# EAGLE schematic megacard_pipico (EAGLE 4.16)
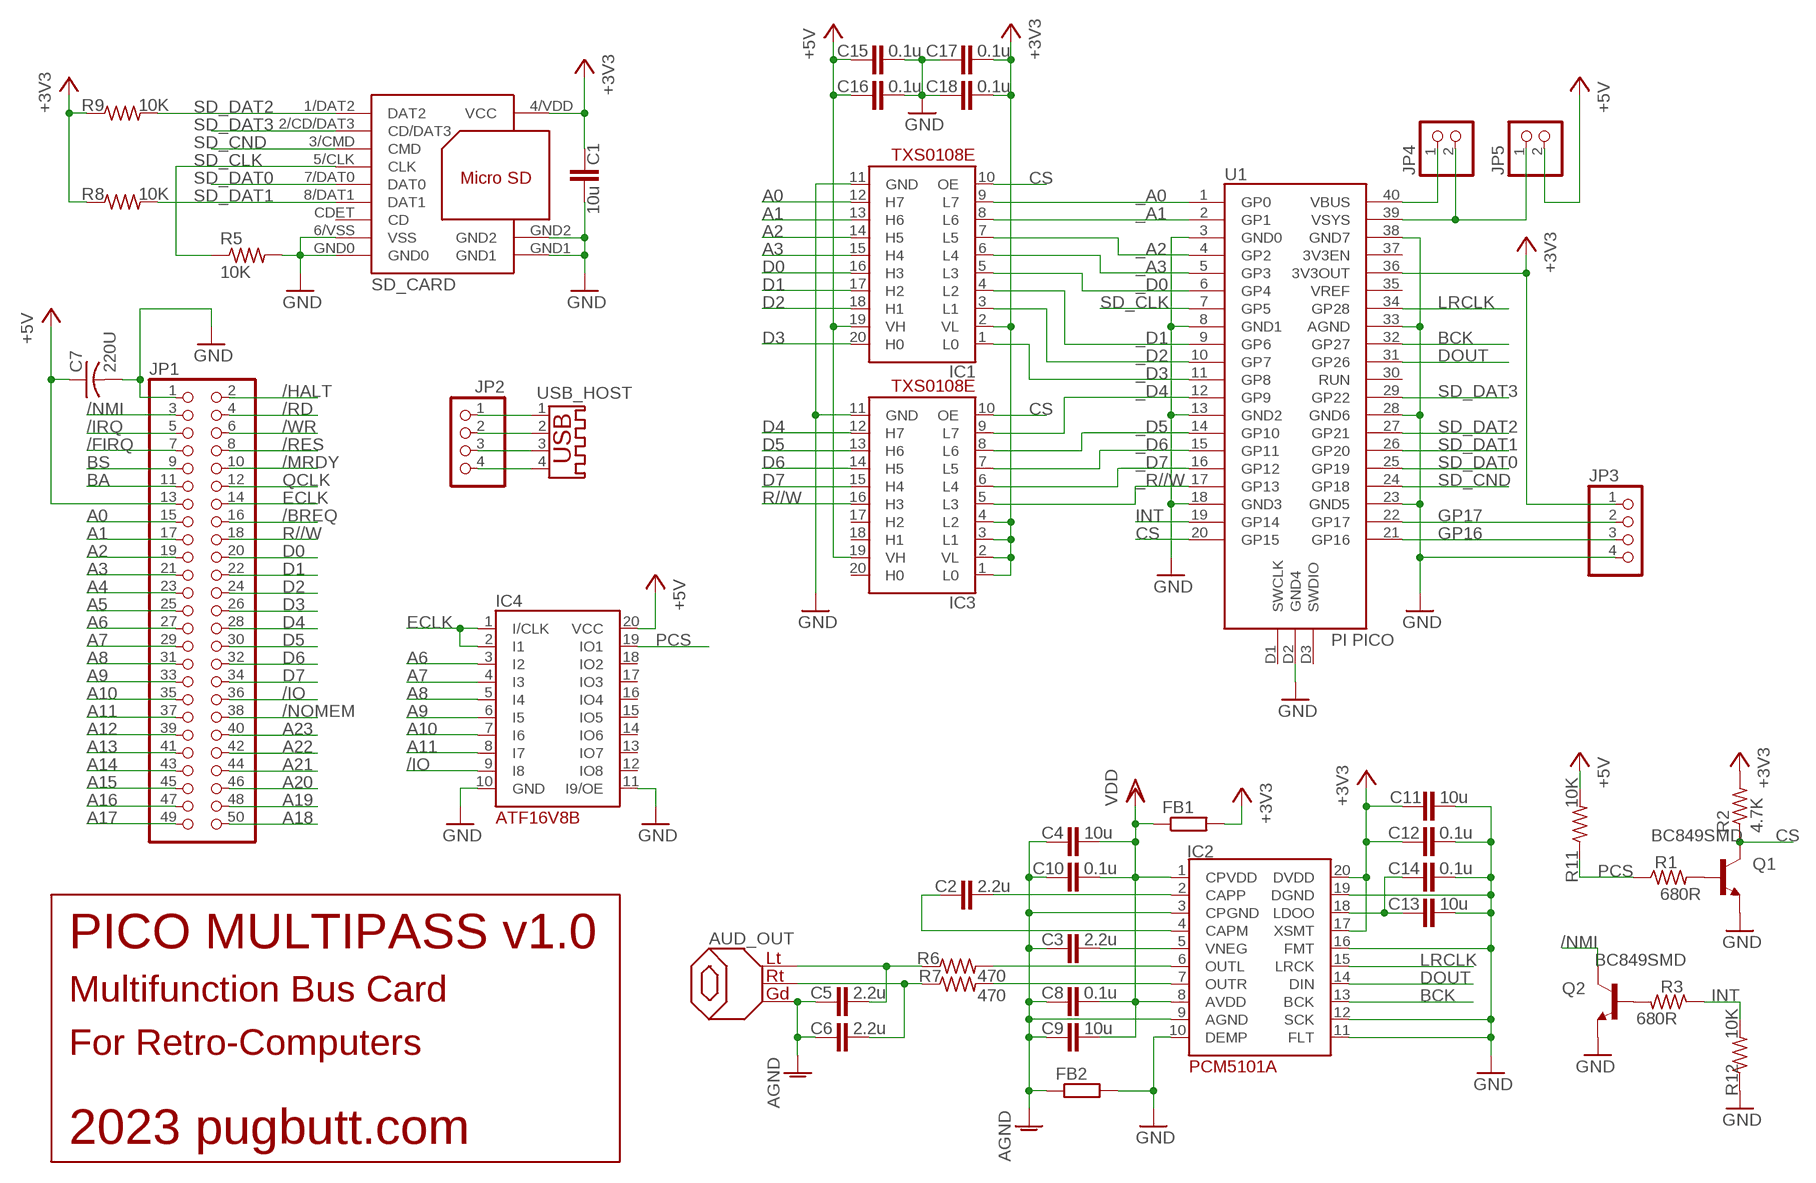
[diagram p0: schematic, sheet 1]

## Parts
AUD_OUT  HPHONE_JACK_DIN  [3.5MM_HPHONE_DIN]
C1  10u  C-EUC0805  [C0805]
C2  2.2u  C-EUC0603  [C0603]
C3  2.2u  C-EUC0603  [C0603]
C4  10u  C-EUC0805  [C0805]
C5  2.2u  C-EUC0603  [C0603]
C6  2.2u  C-EUC0603  [C0603]
C7  220U  C-US025-050X050  [C025-050X050]
C8  0.1u  C-EUC0603  [C0603]
C9  10u  C-EUC0805  [C0805]
C10  0.1u  C-EUC0603  [C0603]
C11  10u  C-EUC0805  [C0805]
C12  0.1u  C-EUC0603  [C0603]
C13  10u  C-EUC0805  [C0805]
C14  0.1u  C-EUC0603  [C0603]
C15  0.1u  C-EUC0603  [C0603]
C16  0.1u  C-EUC0603  [C0603]
C17  0.1u  C-EUC0603  [C0603]
C18  0.1u  C-EUC0603  [C0603]
FB1  R-EU_R0603  [R0603]
FB2  R-EU_R0603  [R0603]
IC1  TXS0108E  [TSSOP20]
IC2  PCM5101A  [TSSOP20]
IC3  TXS0108E  [TSSOP20]
IC4  PLD_ATF16V8B  [DIL20]
JP1  PINHD-2X25  [2X25]
JP2  PINHD-1X4  [1X04]
JP3  PINHD-1X4  [1X04]
JP4  PINHD-1X2  [1X02]
JP5  PINHD-1X2  [1X02]
Q1  BC849SMD  [SOT23-BEC]
Q2  BC849SMD  [SOT23-BEC]
R1  680R  R-US_R0603  [R0603]
R2  4.7K  R-US_R0603  [R0603]
R3  680R  R-US_R0603  [R0603]
R5  10K  R-US_R0603  [R0603]
R6  470  R-US_R0603  [R0603]
R7  470  R-US_R0603  [R0603]
R8  10K  R-US_R0603  [R0603]
R9  10K  R-US_R0603  [R0603]
R11  10K  R-US_R0603  [R0603]
R12  10K  R-US_R0603  [R0603]
SD_CARD  MICROSD_AMPHENOL_GTFP084328  [MICROSD_AMPHENOL_GTFP08432B1HR]
U1  PI_PICO  [PI_PICO]
USB_HOST  USB-A003  [USB-A003]

## Nets
+3V3 [supply]: C1.1 C11.1 C12.1 C17.2 C18.2 FB1.2 IC1.2(VL) IC2.17(XSMT) IC2.20(DVDD) IC3.1(L0) IC3.2(VL) IC3.3(L1) IC3.4(L2) JP3.1 R2.2 R8.1 R9.1 SD_CARD.4/VDD(VCC) U1.36(3V3OUT)
+5V [supply]: C7.1 C15.1 C16.1 IC1.19(VH) IC3.19(VH) IC4.20(VCC) JP1.13 JP5.2 R11.2
/BREQ: JP1.16
/FIRQ: JP1.7
/HALT: JP1.2
/IO: IC4.9(I8) JP1.36
/IRQ: JP1.5
/MRDY: JP1.10
/NMI: JP1.3 Q2.C
/NOMEM: JP1.38
/RD: JP1.4
/RES: JP1.8
/WR: JP1.6
_A0: IC1.9(L7) U1.1(GP0)
_A1: IC1.8(L6) U1.2(GP1)
_A2: IC1.7(L5) U1.4(GP2)
_A3: IC1.6(L4) U1.5(GP3)
_D0: IC1.5(L3) U1.6(GP4)
_D1: IC1.4(L2) U1.9(GP6)
_D2: IC1.3(L1) U1.10(GP7)
_D3: IC1.1(L0) U1.11(GP8)
_D4: IC3.9(L7) U1.12(GP9)
_D5: IC3.8(L6) U1.14(GP10)
_D6: IC3.7(L5) U1.15(GP11)
_D7: IC3.6(L4) U1.16(GP12)
_R//W: IC3.5(L3) U1.17(GP13)
A0: IC1.12(H7) JP1.15
A1: IC1.13(H6) JP1.17
A2: IC1.14(H5) JP1.19
A3: IC1.15(H4) JP1.21
A4: JP1.23
A5: JP1.25
A6: IC4.3(I2) JP1.27
A7: IC4.4(I3) JP1.29
A8: IC4.5(I4) JP1.31
A9: IC4.6(I5) JP1.33
A10: IC4.7(I6) JP1.35
A11: IC4.8(I7) JP1.37
A12: JP1.39
A13: JP1.41
A14: JP1.43
A15: JP1.45
A16: JP1.47
A17: JP1.49
A18: JP1.50
A19: JP1.48
A20: JP1.46
A21: JP1.44
A22: JP1.42
A23: JP1.40
AGND: AUD_OUT.COM(G) C3.1 C4.1 C5.1 C6.1 C8.1 C9.1 C10.1 FB2.1 IC2.3(CPGND) IC2.9(AGND)
BA: JP1.11
BCK: IC2.13(BCK) U1.32(GP27)
BS: JP1.9
CS: IC1.10(OE) IC3.10(OE) Q1.C R2.1 U1.20(GP15)
D0: IC1.16(H3) JP1.20
D1: IC1.17(H2) JP1.22
D2: IC1.18(H1) JP1.24
D3: IC1.20(H0) JP1.26
D4: IC3.12(H7) JP1.28
D5: IC3.13(H6) JP1.30
D6: IC3.14(H5) JP1.32
D7: IC3.15(H4) JP1.34
DOUT: IC2.14(DIN) U1.31(GP26)
ECLK: IC4.1(I/CLK) IC4.2(I1) JP1.14
GND [supply]: C1.2 C7.2 C11.2 C12.2 C13.2 C14.2 C15.2 C16.2 C17.1 C18.1 FB2.2 IC1.11(GND) IC2.10(DEMP) IC2.11(FLT) IC2.12(SCK) IC2.16(FMT) IC2.19(DGND) IC3.11(GND) IC4.10(GND) IC4.11(I9/OE) JP1.1 JP3.4 Q1.E Q2.E R5.2 R12.1 SD_CARD.6/VSS(VSS) SD_CARD.GND0 SD_CARD.GND1 SD_CARD.GND2 U1.3(GND0) U1.8(GND1) U1.13(GND2) U1.18(GND3) U1.23(GND5) U1.28(GND6) U1.33(AGND) U1.38(GND7) U1.D2(GND4)
GP16: JP3.3 U1.21(GP16)
GP17: JP3.2 U1.22(GP17)
INT: R3.1 R12.2 U1.19(GP14)
LDOO: C13.1 C14.1 IC2.18(LDOO)
LRCLK: IC2.15(LRCK) U1.34(GP28)
N$1 [supply]: JP2.1 USB_HOST.1
N$2: JP2.2 USB_HOST.2
N$3: JP2.3 USB_HOST.3
N$4 [supply]: JP2.4 USB_HOST.4
N$5: Q1.B R1.2
N$6 [supply]: JP4.1 U1.40(VBUS)
N$8 [supply]: JP4.2 JP5.1 U1.39(VSYS)
N$19: Q2.B R3.2
N$21: AUD_OUT.L C5.2 R6.1
N$22: AUD_OUT.R C6.2 R7.1
N$23: C2.2 IC2.2(CAPP)
N$24: C2.1 IC2.4(CAPM)
N$26: C3.2 IC2.5(VNEG)
N$27: IC2.6(OUTL) R6.2
N$28: IC2.7(OUTR) R7.2
PCS: IC4.19(IO1) R1.1 R11.1
QCLK: JP1.12
R//W: IC3.16(H3) JP1.18
SD_CLK: R5.1 SD_CARD.5/CLK(CLK) U1.7(GP5)
SD_CND: SD_CARD.3/CMD(CMD) U1.24(GP18)
SD_DAT0: SD_CARD.7/DAT0(DAT0) U1.25(GP19)
SD_DAT1: R8.2 SD_CARD.8/DAT1(DAT1) U1.26(GP20)
SD_DAT2: R9.2 SD_CARD.1/DAT2(DAT2) U1.27(GP21)
SD_DAT3: SD_CARD.2/CD/DAT3(CD/DAT3) U1.29(GP22)
VDD: C4.2 C8.2 C9.2 C10.2 FB1.1 IC2.1(CPVDD) IC2.8(AVDD)
Unconnected: IC3.17(H2) IC3.18(H1) IC3.20(H0) IC4.12(IO8) IC4.13(IO7) IC4.14(IO6) IC4.15(IO5) IC4.16(IO4) IC4.17(IO3) IC4.18(IO2) SD_CARD.CDET(CD) U1.30(RUN) U1.35(VREF) U1.37(3V3EN) U1.D1(SWCLK) U1.D3(SWDIO)

## Notes on the sheet
- PICO MULTIPASS v1.0
- Multifunction Bus Card
- For Retro-Computers
- 2023 pugbutt.com

## Library data of the parts
AUD_OUT = 01-hacker-daw:HPHONE_JACK
C1-C6 C8-C18 = rcl:C-EU: CAPACITOR, European symbol
C7 = rcl:C-US: CAPACITOR, American symbol
FB1 FB2 = rcl:R-EU_: RESISTOR, European symbol
IC1 IC3 = 07-Retrocomputing:TXS0108E
IC2 = 01-hacker-daw:PCM5101A
IC4 = 07-Retrocomputing:PLD_ATF16V8B
JP1 = pinhead:PINHD-2X25: PIN HEADER
JP2 JP3 = pinhead:PINHD-1X4: PIN HEADER
JP4 JP5 = pinhead:PINHD-1X2: PIN HEADER
Q1 Q2 = transistor-npn:BC849*: NPN Transistor
R1-R3 R5-R9 R11 R12 = rcl:R-US_: RESISTOR, American symbol
SD_CARD = 07-Retrocomputing:MICROSD_AMPHENOL_GTFP084328
U1 = 07-Retrocomputing:PI_PICO
USB_HOST = con-yamaichi:USB-A003: USB connector

## Net classes
0 default: width 0.203 mm, drill 0.203 mm, clearance 0.254 mm
1 supply: width 0.406 mm, drill 0.203 mm, clearance 0.305 mm